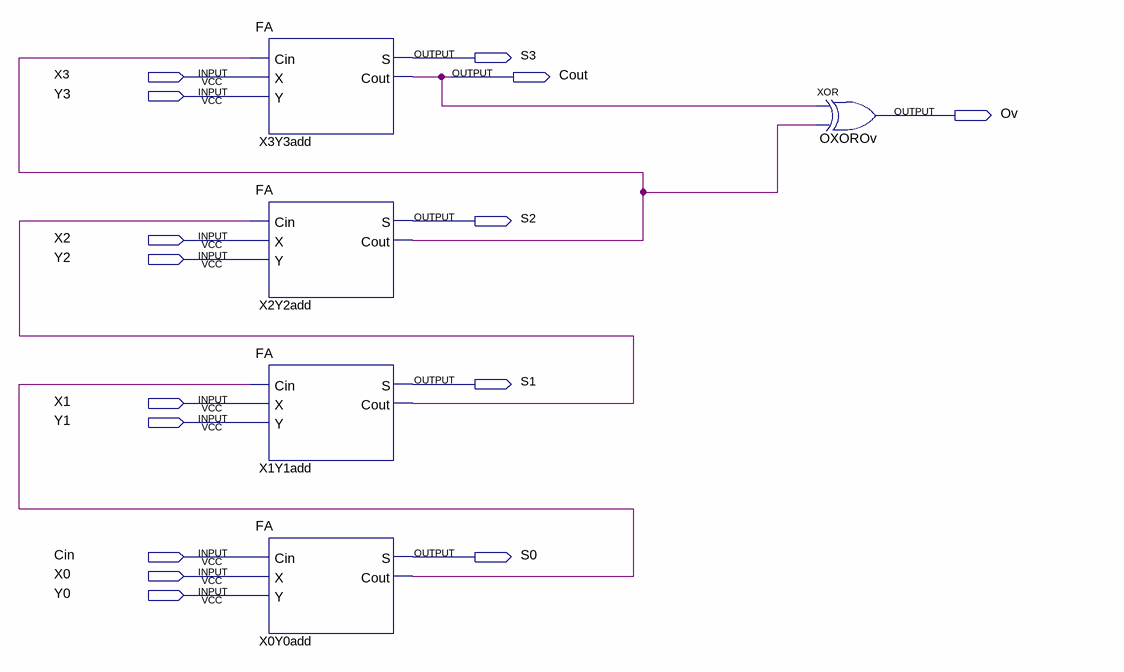
[diagram p0: schematic sheet]
// Quartus schematic adder_4bit.bdf as structural Verilog: 5 symbols, 15 pins
module adder_4bit (
  input  X3,
  input  Y3,
  input  X2,
  input  Y2,
  input  X1,
  input  Y1,
  input  Cin,
  input  X0,
  input  Y0,
  output S3,
  output Cout,
  output Ov,
  output S2,
  output S1,
  output S0
);

  wire X0Y0add_cout, X1Y1add_cout, X2Y2add_cout;

  FA X3Y3add (.Cin(X2Y2add_cout), .X(X3), .Y(Y3), .S(S3), .Cout(Cout));
  FA X2Y2add (.Cin(X1Y1add_cout), .X(X2), .Y(Y2), .S(S2), .Cout(X2Y2add_cout));
  FA X1Y1add (.Cin(X0Y0add_cout), .X(X1), .Y(Y1), .S(S1), .Cout(X1Y1add_cout));
  FA X0Y0add (.Cin(Cin), .X(X0), .Y(Y0), .S(S0), .Cout(X0Y0add_cout));
  xor OXOROv (Ov, Cout, X2Y2add_cout);
endmodule
